# Altium project Triumvi_v11_sensing.PrjPcb
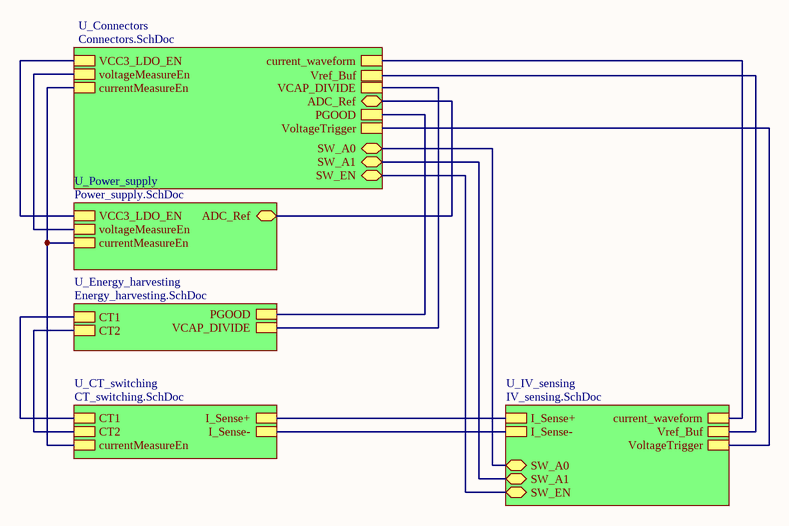
[diagram p0: top.SchDoc]
6 sheets, 69 parts. Net scope: hierarchical (ports join the sheet entries above them; power ports are global).
Board files: triumvi_v11_sensing.PcbDoc, triumvi_v11_sensing_panel.PcbDoc, triumvi_v11_sensing_panel_stencil.PcbDoc
Sheets:
  top.SchDoc
    U_Connectors = Connectors.SchDoc
    U_CT_switching = CT_switching.SchDoc
    U_Energy_harvesting = Energy_harvesting.SchDoc
    U_IV_sensing = IV_sensing.SchDoc
    U_Power_supply = Power_supply.SchDoc

## Sheet top.SchDoc: Triumvi - Sensing - Top
size Letter; Author: Ye-Sheng Kuo; Revision: 10; SheetNumber: 1; SheetTotal: 6

### Sub-sheets
U_Connectors = Connectors.SchDoc: current_waveform, Vref_Buf, VoltageTrigger, PGOOD, VCAP_DIVIDE, VCC3_LDO_EN, voltageMeasureEn, currentMeasureEn, ADC_Ref, SW_A0, SW_A1, SW_EN
U_CT_switching = CT_switching.SchDoc: CT1, CT2, currentMeasureEn, I_Sense+, I_Sense-
U_Energy_harvesting = Energy_harvesting.SchDoc: CT1, CT2, PGOOD, VCAP_DIVIDE
U_IV_sensing = IV_sensing.SchDoc: current_waveform, Vref_Buf, VoltageTrigger, I_Sense+, I_Sense-, SW_A1, SW_EN, SW_A0
U_Power_supply = Power_supply.SchDoc: VCC3_LDO_EN, voltageMeasureEn, currentMeasureEn, ADC_Ref

### Nets
VCC3: sheet U_Connectors/ADC_Ref, sheet U_Power_supply/ADC_Ref
CT1: sheet U_CT_switching/CT1, sheet U_Energy_harvesting/CT1
CT2: sheet U_CT_switching/CT2, sheet U_Energy_harvesting/CT2
current_waveform: sheet U_Connectors/current_waveform, sheet U_IV_sensing/current_waveform
currentMeasureEn: sheet U_Connectors/currentMeasureEn, sheet U_CT_switching/currentMeasureEn, sheet U_Power_supply/currentMeasureEn
in+: sheet U_CT_switching/I_Sense+, sheet U_IV_sensing/I_Sense+
in-: sheet U_CT_switching/I_Sense-, sheet U_IV_sensing/I_Sense-
PGOOD: sheet U_Connectors/PGOOD, sheet U_Energy_harvesting/PGOOD
SW_A0: sheet U_Connectors/SW_A0, sheet U_IV_sensing/SW_A0
SW_A1: sheet U_Connectors/SW_A1, sheet U_IV_sensing/SW_A1
SW_EN: sheet U_Connectors/SW_EN, sheet U_IV_sensing/SW_EN
VCAP: sheet U_Connectors/VCAP_DIVIDE, sheet U_Energy_harvesting/VCAP_DIVIDE
voltageMeasureEn: sheet U_Connectors/voltageMeasureEn, sheet U_Power_supply/voltageMeasureEn
VoltageTrigger: sheet U_Connectors/VoltageTrigger, sheet U_IV_sensing/VoltageTrigger
Vref_Buf: sheet U_Connectors/Vref_Buf, sheet U_IV_sensing/Vref_Buf
NetJ1_9: sheet U_Connectors/VCC3_LDO_EN, sheet U_Power_supply/VCC3_LDO_EN

### Notes on the sheet
- Title
- Date:
- Author:
- Revision:
- Sheet
- of
- University of Michigan
- File:

## Sheet Connectors.SchDoc: Triumvi - Sensing - Connectors
size Letter; Author: Ye-Sheng Kuo; Revision: 10; SheetNumber: 6; SheetTotal: 6
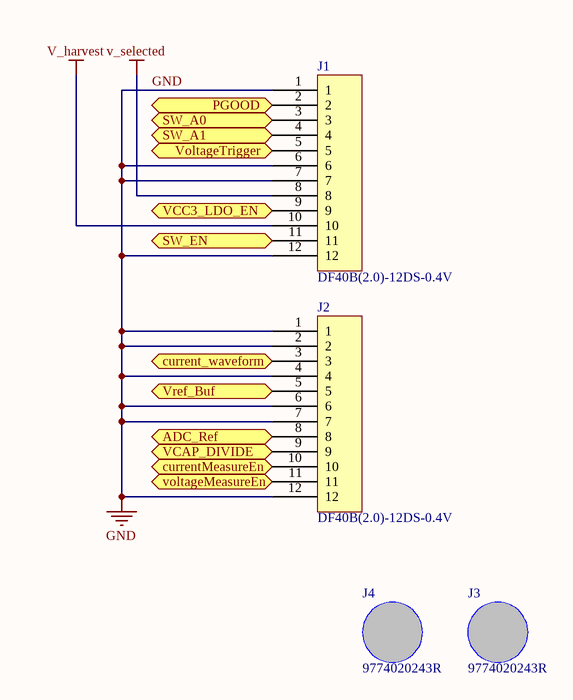
[diagram p1: Connectors.SchDoc]

### Parts
J1  DF40B(2.0)-12DS-0.4V  [DF40B(2.0)-12DS-0.4V]
J2  DF40B(2.0)-12DS-0.4V  [DF40B(2.0)-12DS-0.4V]
J3  9774020243R  [9774020243R]
J4  9774020243R  [9774020243R]

### Ports
ADC_Ref, current_waveform, currentMeasureEn, PGOOD, SW_A0, SW_A1, SW_EN, VCAP_DIVIDE, VCC3_LDO_EN, voltageMeasureEn, VoltageTrigger, Vref_Buf

### Nets
GND: J1.1 J1.6 J1.7 J1.12 J2.1 J2.2 J2.4 J2.6 J2.7 J2.12
V_harvest: J1.10
v_selected: J1.8
VCC3: J2.8 ; port ADC_Ref
current_waveform: J2.3 ; port current_waveform
currentMeasureEn: J2.10 ; port currentMeasureEn
PGOOD: J1.2 ; port PGOOD
SW_A0: J1.3 ; port SW_A0
SW_A1: J1.4 ; port SW_A1
SW_EN: J1.11 ; port SW_EN
VCAP: J2.9 ; port VCAP_DIVIDE
voltageMeasureEn: J2.11 ; port voltageMeasureEn
VoltageTrigger: J1.5 ; port VoltageTrigger
Vref_Buf: J2.5 ; port Vref_Buf
NetJ1_9: J1.9 ; port VCC3_LDO_EN

### Notes on the sheet
- Title
- Date:
- Author:
- Revision:
- Sheet
- of
- University of Michigan
- File:

### Library data of the parts
J1 J2 = DF40B(2.0)-12DS-0.4V: Hirose BM20 Series, 0.4mm pitch, 2mm stack height, 12 pos, header; Supplier 1: Digi-Key; Supplier Part Number 1: H124594CT-ND
J3 J4 = 9774020243R: 2 mm stack height, m2 standoff; Supplier 1: Digi-Key; Supplier Part Number 1: 732-7073-1-ND

## Sheet CT_switching.SchDoc: Triumvi - Sensing - CT Switching
size Letter; Author: Ye-Sheng Kuo; Revision: 10; SheetNumber: 5; SheetTotal: 6
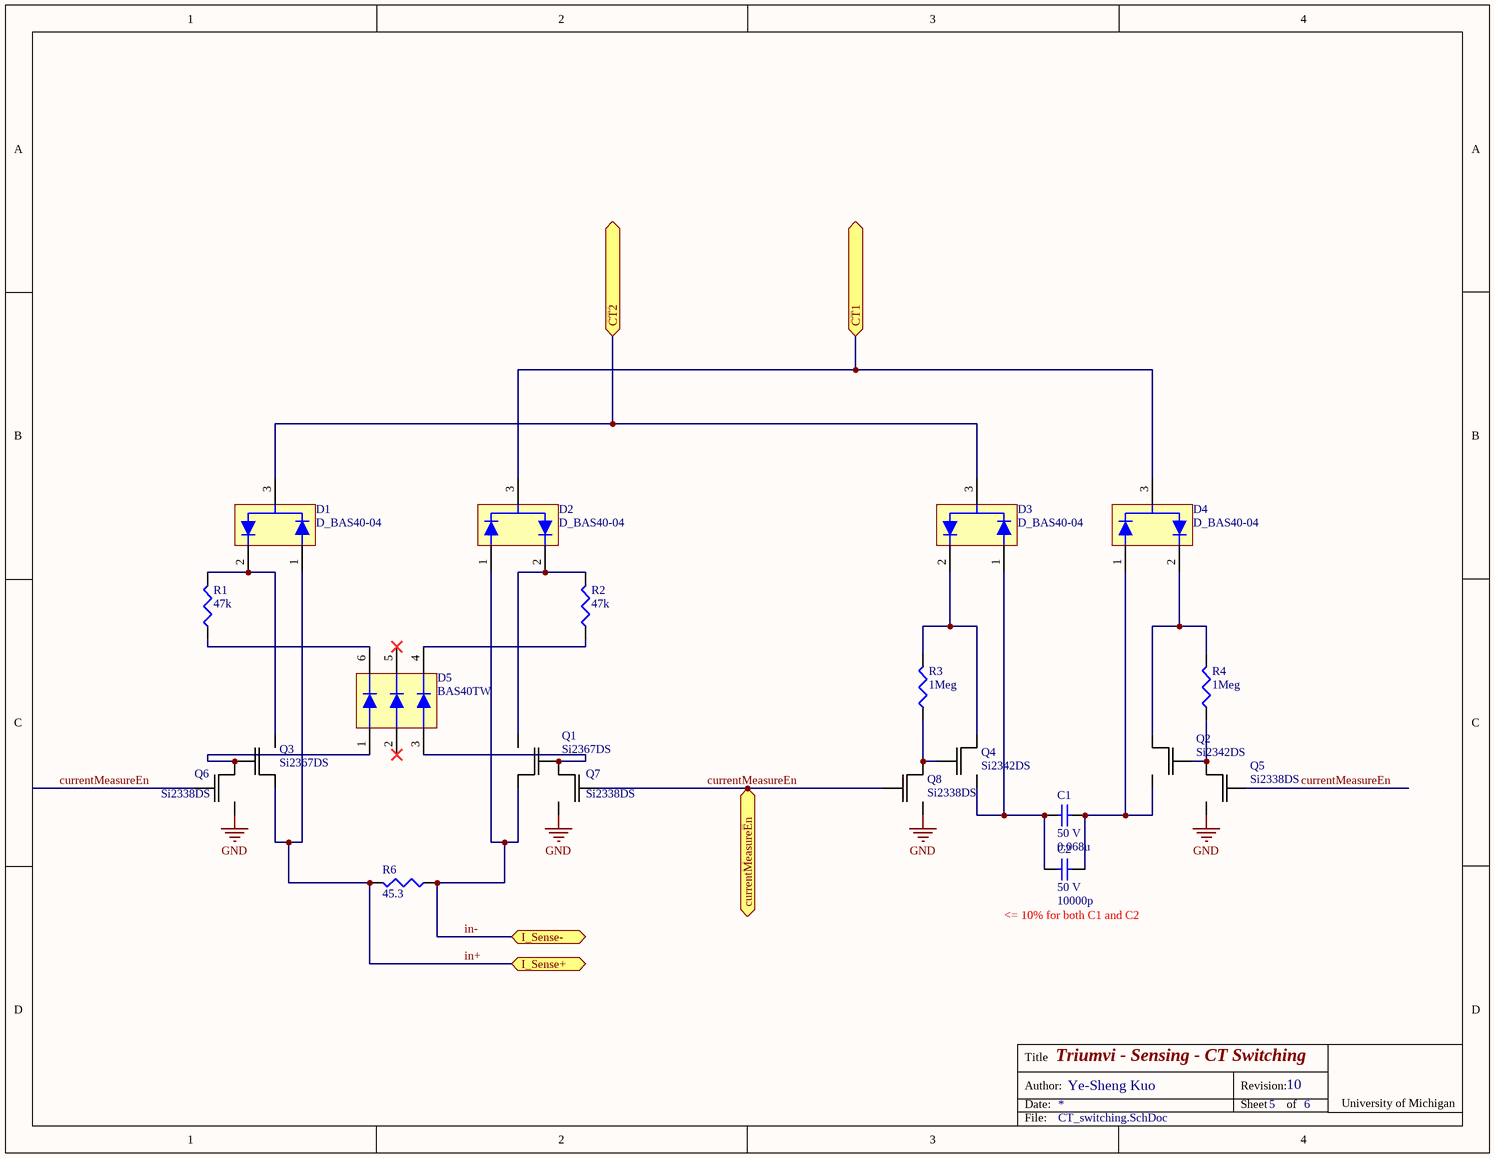
[diagram p2: CT_switching.SchDoc]

### Parts
C1  voltage rated: 50 V  [0603]  (hidden comment: 0.068u)
C2  voltage rated: 50 V  [0603]  (hidden comment: 10000p)
D1  D_BAS40-04  [SOT23-3]
D2  D_BAS40-04  [SOT23-3]
D3  D_BAS40-04  [SOT23-3]
D4  D_BAS40-04  [SOT23-3]
D5  BAS40TW  [SOT-363]
Q1  Si2367DS  [SOT23-3]
Q2  Si2342DS  [SOT23-3]
Q3  Si2367DS  [SOT23-3]
Q4  Si2342DS  [SOT23-3]
Q5  Si2338DS  [SOT23-3]
Q6  Si2338DS  [SOT23-3]
Q7  Si2338DS  [SOT23-3]
Q8  Si2338DS  [SOT23-3]
R1  47k  [0402]
R2  47k  [0402]
R3  1Meg  [0402]
R4  1Meg  [0402]
R6  45.3  [0603]

### Ports
CT1, CT2, currentMeasureEn, I_Sense+, I_Sense-

### Nets
GND: Q5.2(S) Q6.2(S) Q7.2(S) Q8.2(S)
CT1: D2.3 D4.3 ; port CT1
CT2: D1.3 D3.3 ; port CT2
currentMeasureEn: Q5.1(G) Q6.1(G) Q7.1(G) Q8.1(G) ; port currentMeasureEn
in+: D1.1 Q3.3(D) R6.1 ; port I_Sense+
in-: D2.1 Q1.3(D) R6.2 ; port I_Sense-
NetC1_1: C1.1 C2.1 D3.1 Q4.2(S)
NetC1_2: C1.2 C2.2 D4.1 Q2.2(S)
NetD1_2: D1.2 Q3.2(S) R1.1
NetD2_2: D2.2 Q1.2(S) R2.1
NetD3_2: D3.2 Q4.3(D) R3.1
NetD4_2: D4.2 Q2.3(D) R4.1
NetD5_1: D5.1 Q3.1(G) Q6.3(D)
NetD5_3: D5.3 Q1.1(G) Q7.3(D)
NetD5_4: D5.4 R2.2
NetD5_6: D5.6 R1.2
NetQ2_1: Q2.1(G) Q5.3(D) R4.2
NetQ4_1: Q4.1(G) Q8.3(D) R3.2

Not connected (* = marked no-connect by the designer): D5 2* 5*

### Notes on the sheet
- (near C2) <= 10% for both C1 and C2
- Title
- Date:
- Author:
- Revision:
- Sheet
- of
- University of Michigan
- File:

### Library data of the parts
C1 = C0603C683K5RACTU: 0.068µF ±10% 50V Ceramic Capacitor X7R 0603; Manufacture: Kemet; tolerance: 10%; package: 0603; Supplier 1: Digi-Key; Supplier Part Number 1: 399-7955-1-ND; Value: 0.068u; Temperature Coefficient: X7R; Manufacturer Part Number: C0603C683K5RACTU
C2 = C0603C103J5RACTU: 10000pF ±5% 50V Ceramic Capacitor X7R 0603; Manufacture: Kemet; tolerance: 5%; package: 0603; Supplier 1: Digi-Key; Supplier Part Number 1: 399-1092-6-ND; Value: 10000p; Temperature Coefficient: X7R; Manufacturer Part Number: C0603C103J5RACTU
D1-D4 = D_BAS40-04: SURFACE MOUNT SCHOTTKY BARRIER DIODE; Supplier 1: Digi-Key; Supplier Part Number 1: BAS40-04FDICT-ND
D5 = D_BAS40TW: SURFACE MOUNT SCHOTTKY BARRIER DIODE ARRAYS; Supplier 1: Digi-Key; Supplier Part Number 1: BAS40TW-FDICT-ND
Q1 Q3 = Si2367DS: P-Channel 20 V (D-S) MOSFET; Supplier 1: Digi-Key; Supplier Part Number 1: SI2367DS-T1-GE3CT-ND
Q2 Q4 = Si2342DS: N-Channel 8 V (D-S) MOSFET; Supplier 1: Digi-Key; Supplier Part Number 1: SI2342DS-T1-GE3CT-ND
Q5-Q8 = Si2338DS: N-Channel 30 V (D-S) MOSFET; Supplier 1: Digi-Key; Supplier Part Number 1: SI2338DS-T1-GE3CT-ND
R1 R2 = CRCW040247K0FKED: RES SMD 47K OHM 1% 1/16W 0402; Manufacturer: Vishay Dale; Temperature Coefficient: 100 ppm/C; Tolerance: 1%; Power: 1/16 W; package: 0402; Supplier 1: Digi-Key; Supplier Part Number 1: 541-47.0KLCT-ND; value: 47k; Manufacturer Part Number: CRCW040247K0FKED
R3 R4 = CRCW04021M00FKED: RES SMD 1M OHM 1% 1/16W 0402; Manufacturer: Vishay Dale; Temperature Coefficient: 100 ppm/C; Tolerance: 1%; Power: 1/16 W; Supplier 1: Digi-Key; Supplier Part Number 1: 541-1.00MLCT-ND; package: 0402; value: 1Meg; Manufacturer Part Number: CRCW04021M00FKED
R6 = RP73PF1J45R3BTDF: RES SMD 45.3 OHM 0.1% 1/6W 0603; Manufacturer: TE Connectivity; Temperature Coefficient: 25 ppm/C; Power: 1/6 W; package: 0603; Supplier 1: Digi-Key; Supplier Part Number 1: A109979CT-ND; Tolerance: 0.1%; value: 45.3; Manufacturer Part Number: RP73PF1J45R3BTDF

## Sheet Energy_harvesting.SchDoc: Triumvi - Sensing - Energy Harvesting
size Letter; Author: Ye-Sheng Kuo; Revision: 10; SheetNumber: 2; SheetTotal: 6
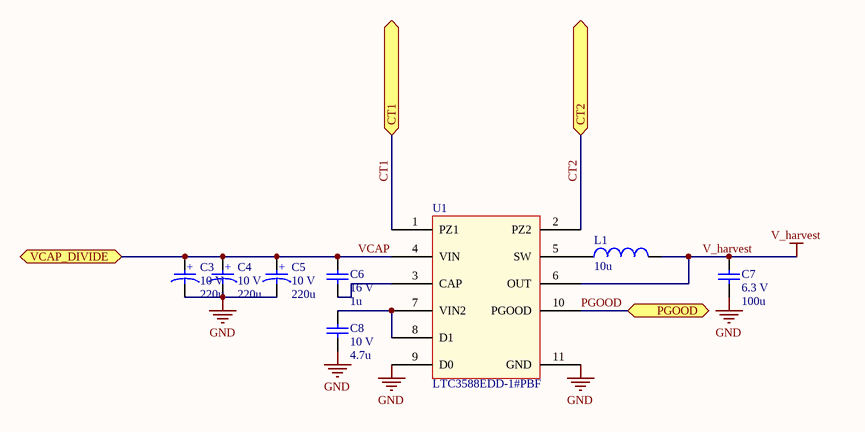
[diagram p3: Energy_harvesting.SchDoc]

### Parts
C3  voltage rated: 10 V  [2312]  (hidden comment: 220u)
C4  voltage rated: 10 V  [2312]  (hidden comment: 220u)
C5  voltage rated: 10 V  [2312]  (hidden comment: 220u)
C6  voltage rated: 16 V  [0402]  (hidden comment: 1u)
C7  voltage rated: 6.3 V  [1206]  (hidden comment: 100u)
C8  voltage rated: 10 V  [0603]  (hidden comment: 4.7u)
L1  10u  [CDRH2D18]
U1  LTC3588EDD-1#PBF  [QFN-10]

### Ports
CT1, CT2, PGOOD, VCAP_DIVIDE

### Nets
GND: C3.2 C4.2 C5.2 C7.2 C8.2 U1.9(D0) U1.11(GND)
V_harvest: C7.1 L1.1 U1.6(OUT)
CT1: U1.1(PZ1) ; port CT1
CT2: U1.2(PZ2) ; port CT2
PGOOD: U1.10(PGOOD) ; port PGOOD
VCAP: C3.1 C4.1 C5.1 C6.1 U1.4(VIN) ; port VCAP_DIVIDE
NetC6_2: C6.2 U1.3(CAP)
NetC8_1: C8.1 U1.7(VIN2) U1.8(D1)
NetL1_2: L1.2 U1.5(SW)

### Notes on the sheet
- Title
- Date:
- Author:
- Revision:
- Sheet
- of
- University of Michigan
- File:
- (in symbol TAJC227K010RNJ) +

### Library data of the parts
C3-C5 = TAJC227K010RNJ: 220µF ±10% Molded Tantalum Capacitors 10V 2312; Manufacture: AVX; ESR: 500m Ohm; tolerance: 10%; package: 2312; Supplier 1: Digi-Key; Supplier Part Number 1: 478-4774-1-ND; Value: 220u; Manufacturer Part Number: TAJC227K010RNJ
C6 = C1005X6S1C105K050BC: 1µF ±10% 16V Ceramic Capacitor X6S 0402; Manufacture: TDK; tolerance: 10%; package: 0402; Supplier 1: Digi-Key; Supplier Part Number 1: 445-9086-1-ND; Value: 1u; Temperature Coefficient: X6S; Manufacturer Part Number: C1005X6S1C105K050BC
C7 = GRM31CR60J107ME39K: 100µF ±20% 6.3V Ceramic Capacitor X5R 1206; Manufacture: Kemet; tolerance: 20%; package: 1206; Supplier 1: Digi-Key; Supplier Part Number 1: 490-7217-1-ND; Value: 100u; Temperature Coefficient: X5R; Manufacturer Part Number: GRM31CR60J107ME39K
C8 = CGB3B1X5R1A475K055AC: 4.7µF ±10% 10V Ceramic Capacitor X5R 0603; Manufacture: TDK; tolerance: 10%; package: 0603; Supplier 1: Digi-Key; Supplier Part Number 1: 445-7482-1-ND; Value: 4.7u; Temperature Coefficient: X5R; Manufacturer Part Number: CGB3B1X5R1A475K055AC
L1 = CDRH2D18/LDNP-100NC: 10µH Shielded Inductor 1A 180 mOhm Max Nonstandard; Manufacturer: Sumida; tolerance: 30%; DCR (Max): 180m; Supplier 1: Digi-Key; Supplier Part Number 1: 308-1959-1-ND; Value: 10u; Current Rating: 1 A; Manufacturer Part Number: CDRH2D18/LDNP-100NC
U1 = LTC3588EDD-1#PBF: Piezoelectric Energy Harvesting Power Supply; Supplier 1: Digi-Key; Supplier Part Number 1: LTC3588EDD-1#PBF-ND

## Sheet IV_sensing.SchDoc: Triumvi - Sensing - IV Sensing
size Letter; Author: Ye-Sheng Kuo; Revision: 10; SheetNumber: 3; SheetTotal: 6
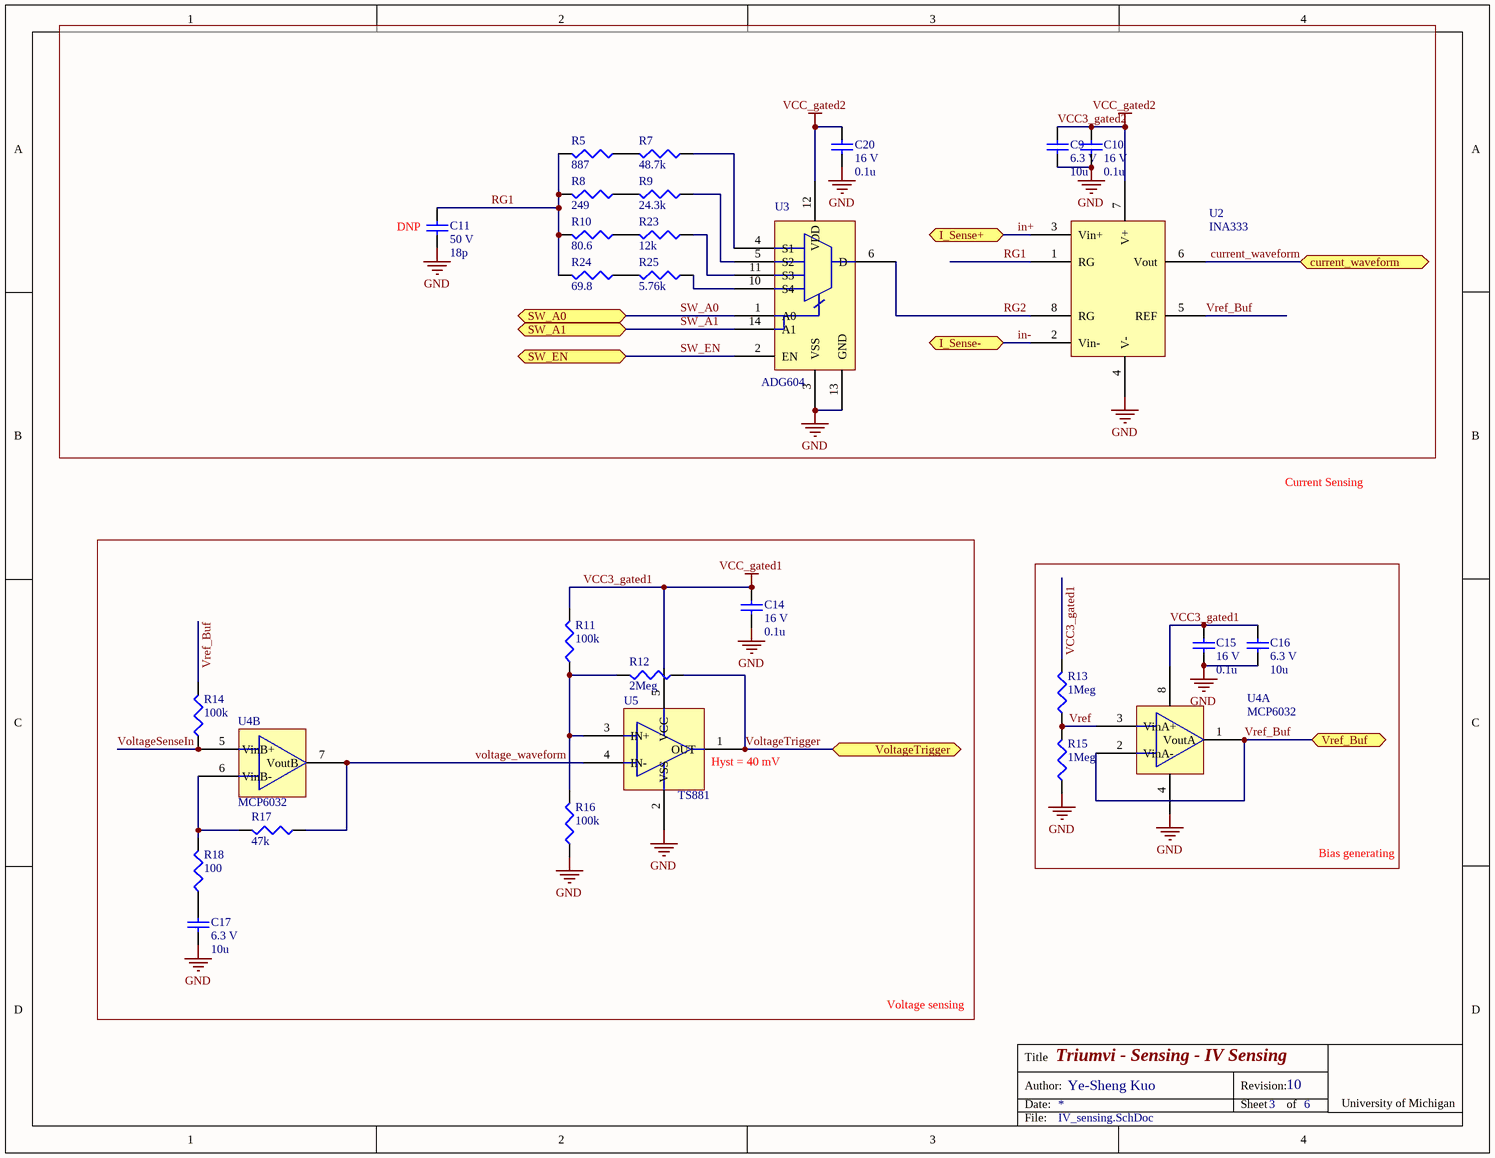
[diagram p4: IV_sensing.SchDoc]

### Parts
C9  voltage rated: 6.3 V  [0603]  (hidden comment: 10u)
C10  voltage rated: 16 V  [0402]  (hidden comment: 0.1u)
C11  voltage rated: 50 V  [0402]  (hidden comment: 18p)
C14  voltage rated: 16 V  [0402]  (hidden comment: 0.1u)
C15  voltage rated: 16 V  [0402]  (hidden comment: 0.1u)
C16  voltage rated: 6.3 V  [0603]  (hidden comment: 10u)
C17  voltage rated: 6.3 V  [0603]  (hidden comment: 10u)
C20  voltage rated: 16 V  [0402]  (hidden comment: 0.1u)
R5  887  [0402]
R7  48.7k  [0402]
R8  249  [0402]
R9  24.3k  [0402]
R10  80.6  [0402]
R11  100k  [0402]
R12  2Meg  [0402]
R13  1Meg  [0402]
R14  100k  [0402]
R15  1Meg  [0402]
R16  100k  [0402]
R17  47k  [0402]
R18  100  [0402]
R23  12k  [0402]
R24  69.8  [0402]
R25  5.76k  [0402]
U2  INA333  [MSOP-8]
U3  ADG604  [TSSOP-14]
U4  MCP6032  [MSOP-8]  (parts A,B of 2)
U5  TS881  [SC70-5]

### Blocks framed on the sheet
DNP: C9-C11 C20 R5 R7-R10 R23-R25 U2 U3
Bias generating: C15 C16 R13 R15 U4

### Ports
current_waveform, I_Sense+, I_Sense-, SW_A0, SW_A1, SW_EN, VoltageTrigger, Vref_Buf

### Nets
GND: C9.2 C10.2 C11.2 C14.2 C15.2 C16.2 C17.2 C20.2 R15.2 R16.2 U2.4(V-) U3.3(VSS) U3.13(GND) U4.4(VSS) U5.2(VSS)
VCC3_gated1: C14.1 C15.1 C16.1 R11.1 R13.1 U4.8(VDD) U5.5(VCC)  [also labelled VCC_gated1]
VCC3_gated2: C9.1 C10.1 C20.1 U2.7(V+) U3.12(VDD)  [also labelled VCC_gated2]
current_waveform: U2.6(Vout) ; port current_waveform
in+: U2.3(Vin+) ; port I_Sense+
in-: U2.2(Vin-) ; port I_Sense-
RG1: C11.1 R5.1 R8.1 R10.1 R24.1 U2.1(RG)
RG2: U2.8(RG) U3.6(D)
SW_A0: U3.1(A0) ; port SW_A0
SW_A1: U3.14(A1) ; port SW_A1
SW_EN: U3.2(EN) ; port SW_EN
voltage_waveform: R17.2 U4.7(VoutB) U5.4(IN-)
VoltageSenseIn: R14.2 U4.5(VinB+)
VoltageTrigger: R12.2 U5.1(OUT) ; port VoltageTrigger
Vref: R13.2 R15.1 U4.3(VinA+)
Vref_Buf: R14.1 U2.5(REF) U4.1(VoutA) U4.2(VinA-) ; port Vref_Buf
NetC17_1: C17.1 R18.2
NetR5_2: R5.2 R7.1
NetR7_2: R7.2 U3.4(S1)
NetR8_2: R8.2 R9.1
NetR9_2: R9.2 U3.5(S2)
NetR10_2: R10.2 R23.1
NetR11_2: R11.2 R12.1 R16.1 U5.3(IN+)
NetR17_1: R17.1 R18.1 U4.6(VinB-)
NetR23_2: R23.2 U3.11(S3)
NetR24_2: R24.2 R25.1
NetR25_2: R25.2 U3.10(S4)

### Notes on the sheet
- Current Sensing
- (near U5) Hyst = 40 mV
- Voltage sensing
- Title
- Date:
- Author:
- Revision:
- Sheet
- of
- University of Michigan
- File:

### Library data of the parts
C9 C16 C17 = C1608X5R0J106M080AB: 10µF ±20% 6.3V Ceramic Capacitor X5R 0603; Manufacture: TDK; tolerance: 20%; package: 0603; Supplier 1: Digi-Key; Supplier Part Number 1: 445-4112-1-ND; Value: 10u; Temperature Coefficient: X5R; Manufacturer Part Number: C1608X5R0J106M080AB
C10 C14 C15 C20 = GRM155R71C104KA88D: 0.10µF ±10% 16V Ceramic Capacitor X7R 0402; Manufacture: Murata; tolerance: 10%; package: 0402; Supplier 1: Digi-Key; Supplier Part Number 1: 490-3261-1-ND; Value: 0.1u; Temperature Coefficient: X7R; Manufacturer Part Number: GRM155R71C104KA88D
C11 = 500R07S180GV4T: 18pF ±2% 50V Ceramic Capacitor C0G, NP0 0402; Manufacture: Johanson Technology Inc.; Note: RF application; tolerance: 2%; package: 0402; Temperature Coefficient: C0G, NP0; Manufacturer Part Number: 500R07S180GV4T; Supplier 1: Digi-Key; Supplier Part Number 1: 712-1264-1-ND; Value: 18p
R5 = CRCW0402887RFKED: RES SMD 887 OHM 1% 1/16W 0402; Manufacturer: Vishay Dale; Temperature Coefficient: 100 ppm/C; package: 0402; Manufacturer Part Number: CRCW0402887RFKED; Power: 1/16 W; Tolerance: 1%; Supplier 1: Digi-Key; Supplier Part Number 1: 541-887LCT-ND; value: 887
R7 = RT0402DRD0748K7L: RES SMD 48.7K OHM 0.5% 1/16W 0402; Manufacturer: Yageo; Temperature Coefficient: 25 ppm/C; package: 0402; Manufacturer Part Number: RT0402DRD0748K7L; Power: 1/16 W; Tolerance: 0.5%; Supplier 1: Digi-Key; Supplier Part Number 1: 311-2188-1-ND; value: 48.7k
R8 = CRCW0402249RFKED: RES SMD 249 OHM 1% 1/16W 0402; Manufacturer: Vishay Dale; Temperature Coefficient: 100 ppm/C; package: 0402; Manufacturer Part Number: CRCW0402249RFKED; Power: 1/16 W; Tolerance: 1%; Supplier 1: Digi-Key; Supplier Part Number 1: 541-249LCT-ND; value: 249
R9 = RC0402FR-0724K3L: RES SMD 24.3K OHM 0.5% 1/16W 0402; Manufacturer: Yageo; Temperature Coefficient: 100 ppm/C; Tolerance: 1%; package: 0402; Manufacturer Part Number: RC0402FR-0724K3L; Power: 1/16 W; Supplier 1: Digi-Key; Supplier Part Number 1: YAG3071CT-ND; value: 24.3k
R10 = CRCW040280R6FKED: RES SMD 80.6 OHM 1% 1/16W 0402; Manufacturer: Vishay Dale; Temperature Coefficient: 100 ppm/C; package: 0402; Manufacturer Part Number: CRCW040280R6FKED; Power: 1/16 W; Tolerance: 1%; Supplier 1: Digi-Key; Supplier Part Number 1: 541-80.6LCT-ND; value: 80.6
R11 R14 R16 = CRCW0402100KFKED: RES SMD 100K OHM 1% 1/16W 0402; Manufacturer: Vishay Dale; Temperature Coefficient: 100 ppm/C; Tolerance: 1%; Power: 1/16 W; Supplier 1: Digi-Key; Supplier Part Number 1: 541-100KLCT-ND; package: 0402; value: 100k; Manufacturer Part Number: CRCW0402100KFKED
R12 = CRCW04022M00FKED: RES SMD 2M OHM 1% 1/16W 0402; Manufacturer: Vishay Dale; Temperature Coefficient: 100 ppm/C; Tolerance: 1%; Power: 1/16 W; package: 0402; Supplier 1: Digi-Key; Supplier Part Number 1: 541-2.00MLCT-ND; value: 2Meg; Manufacturer Part Number: CRCW04022M00FKED
R13 R15 = CRCW04021M00FKED: as R3 on sheet CT_switching; Tolerance: 1%; Power: 1/16 W; Supplier 1: Digi-Key; Supplier Part Number 1: 541-1.00MLCT-ND; package: 0402; value: 1Meg; Manufacturer Part Number: CRCW04021M00FKED
R17 = CRCW040247K0FKED: as R1 on sheet CT_switching; Tolerance: 1%; Power: 1/16 W; package: 0402; Supplier 1: Digi-Key; Supplier Part Number 1: 541-47.0KLCT-ND; value: 47k; Manufacturer Part Number: CRCW040247K0FKED
R18 = CRCW0402100RFKED: RES SMD 100 OHM 1% 1/16W 0402; Manufacturer: Vishay Dale; Temperature Coefficient: 100 ppm/C; Tolerance: 1%; Power: 1/16 W; package: 0402; Supplier 1: Digi-Key; Supplier Part Number 1: 541-100LCT-ND; value: 100; Manufacturer Part Number: CRCW0402100RFKED
R23 = RT0402DRD0712KL: RES SMD 12K OHM 0.5% 1/16W 0402; Manufacturer: Yageo; Temperature Coefficient: 25 ppm/C; package: 0402; Manufacturer Part Number: RT0402DRD0712KL; Power: 1/16 W; Tolerance: 0.5%; Supplier 1: Digi-Key; Supplier Part Number 1: 311-2140-1-ND; value: 12k
R24 = CRCW040269R8FKED: RES SMD 69.8 OHM 1% 1/16W 0402; Manufacturer: Vishay Dale; Temperature Coefficient: 100 ppm/C; package: 0402; Manufacturer Part Number: CRCW040269R8FKED; Power: 1/16 W; Tolerance: 1%; Supplier 1: Digi-Key; Supplier Part Number 1: 541-69.8LCT-ND; value: 69.8
R25 = RC0402FR-075K76L: RES SMD 5.76K OHM 0.5% 1/16W 0402; Manufacturer: Yageo; Temperature Coefficient: 100 ppm/C; Tolerance: 1%; package: 0402; Manufacturer Part Number: RC0402FR-075K76L; Power: 1/16 W; Supplier 1: Digi-Key; Supplier Part Number 1: YAG3196CT-ND; value: 5.76k
U2 = INA333: Micro-Power (50uA), Zero-Drift, Rail-to-Rail Out  Instrumentation Amplifier; Supplier 1: Digi-Key; Supplier Part Number 1: 296-23564-1-ND
U3 = ADG604: 1 pC Charge Injection, 100 pA Leakage  CMOS  5 V/5 V/3 V 4-Channel Multiplexer; Supplier 1: Digi-Key; Supplier Part Number 1: ADG604YRUZ-ND
U4 = MCP6032: 0.9 µA, High Precision Op Amps; Supplier 1: Digi-Key; Supplier Part Number 1: MCP6032-E/MS-ND
U5 = TS881: Rail-to-rail 0.9 V nanopower comparator; Supplier 1: Digi-Key; Supplier Part Number 1: 497-13217-1-ND

## Sheet Power_supply.SchDoc: Triumvi - Sensing - Power Supply
size Letter; Author: Ye-Sheng Kuo; Revision: 10; SheetNumber: 4; SheetTotal: 6
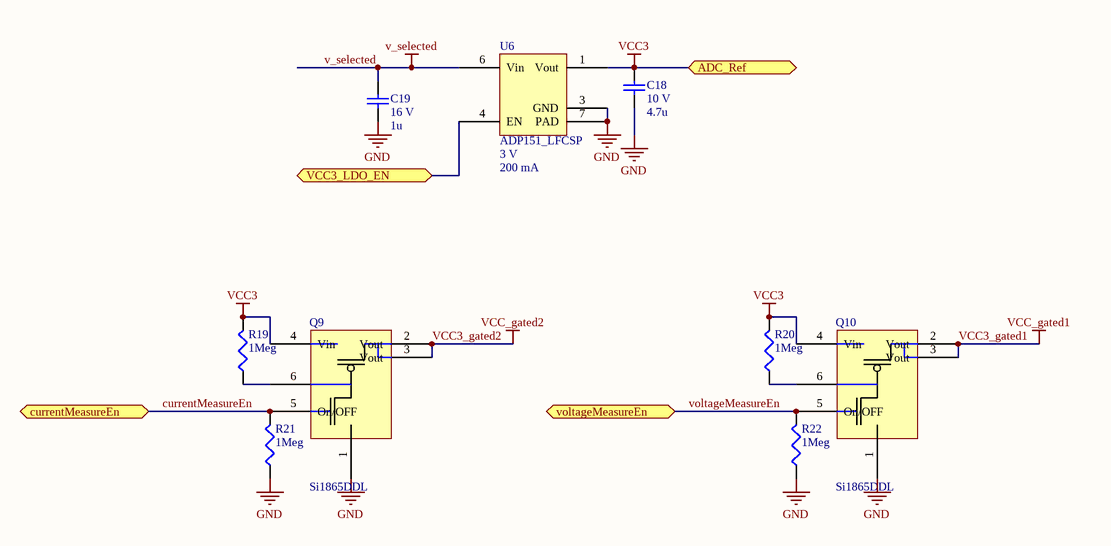
[diagram p5: Power_supply.SchDoc]

### Parts
C18  voltage rated: 10 V  [0603]  (hidden comment: 4.7u)
C19  voltage rated: 16 V  [0402]  (hidden comment: 1u)
Q9  Si1865DDL  [SC70-6]
Q10  Si1865DDL  [SC70-6]
R19  1Meg  [0402]
R20  1Meg  [0402]
R21  1Meg  [0402]
R22  1Meg  [0402]
U6  ADP151_LFCSP  Voltage: 3 V  Current: 200 mA  [CP-6-3]

### Ports
ADC_Ref, currentMeasureEn, VCC3_LDO_EN, voltageMeasureEn

### Nets
GND: C18.2 C19.2 Q9.1(S1) Q10.1(S1) R21.2 R22.2 U6.3(GND) U6.7(PAD)
v_selected: C19.1 U6.6(Vin)
VCC3: C18.1 Q9.4(Vin) Q10.4(Vin) R19.1 R20.1 U6.1(Vout) ; port ADC_Ref
VCC3_gated1: Q10.2(Vout) Q10.3(Vout)  [also labelled VCC_gated1]
VCC3_gated2: Q9.2(Vout) Q9.3(Vout)  [also labelled VCC_gated2]
currentMeasureEn: Q9.5(On/OFF) R21.1 ; port currentMeasureEn
voltageMeasureEn: Q10.5(On/OFF) R22.1 ; port voltageMeasureEn
NetJ1_9: U6.4(EN) ; port VCC3_LDO_EN
NetQ9_6: Q9.6(D1) R19.2
NetQ10_6: Q10.6(D1) R20.2

### Notes on the sheet
- Title
- Date:
- Author:
- Revision:
- Sheet
- of
- University of Michigan
- File:

### Library data of the parts
C18 = CGB3B1X5R1A475K055AC: as C8 on sheet Energy_harvesting; tolerance: 10%; package: 0603; Supplier 1: Digi-Key; Supplier Part Number 1: 445-7482-1-ND; Value: 4.7u; Temperature Coefficient: X5R; Manufacturer Part Number: CGB3B1X5R1A475K055AC
C19 = C1005X6S1C105K050BC: as C6 on sheet Energy_harvesting; tolerance: 10%; package: 0402; Supplier 1: Digi-Key; Supplier Part Number 1: 445-9086-1-ND; Value: 1u; Temperature Coefficient: X6S; Manufacturer Part Number: C1005X6S1C105K050BC
Q9 Q10 = Si1865DDL: Load Switch with Level-Shift; Supplier 1: Digi-Key; Supplier Part Number 1: SI1865DDL-T1-GE3CT-ND
R19-R22 = CRCW04021M00FKED: as R3 on sheet CT_switching; Tolerance: 1%; Power: 1/16 W; Supplier 1: Digi-Key; Supplier Part Number 1: 541-1.00MLCT-ND; package: 0402; value: 1Meg; Manufacturer Part Number: CRCW04021M00FKED
U6 = ADP151_LFCSP: Ultralow Noise, 200 mA,  CMOS Linear Regulator; Supplier 1: Digi-Key; Supplier Part Number 1: ADP151ACPZ-3.0-R7CT-ND

## Nets that join several sheets
GND: Connectors (10 pins), CT_switching (Q5.2 Q6.2 Q7.2 Q8.2), Energy_harvesting (7 pins), IV_sensing (15 pins), Power_supply (8 pins)
V_harvest: Connectors (J1.10), Energy_harvesting (C7.1 L1.1 U1.6)
v_selected: Connectors (J1.8), Power_supply (C19.1 U6.6)
VCC3: Connectors (J2.8), Power_supply (6 pins)
VCC3_gated1: IV_sensing (7 pins), Power_supply (Q10.2 Q10.3)
VCC3_gated2: IV_sensing (5 pins), Power_supply (Q9.2 Q9.3)
CT1: CT_switching (D2.3 D4.3), Energy_harvesting (U1.1)
CT2: CT_switching (D1.3 D3.3), Energy_harvesting (U1.2)
current_waveform: Connectors (J2.3), IV_sensing (U2.6)
currentMeasureEn: Connectors (J2.10), CT_switching (Q5.1 Q6.1 Q7.1 Q8.1), Power_supply (Q9.5 R21.1)
in+: CT_switching (D1.1 Q3.3 R6.1), IV_sensing (U2.3)
in-: CT_switching (D2.1 Q1.3 R6.2), IV_sensing (U2.2)
NetJ1_9: Connectors (J1.9), Power_supply (U6.4)
PGOOD: Connectors (J1.2), Energy_harvesting (U1.10)
SW_A0: Connectors (J1.3), IV_sensing (U3.1)
SW_A1: Connectors (J1.4), IV_sensing (U3.14)
SW_EN: Connectors (J1.11), IV_sensing (U3.2)
VCAP: Connectors (J2.9), Energy_harvesting (5 pins)
voltageMeasureEn: Connectors (J2.11), Power_supply (Q10.5 R22.1)
VoltageTrigger: Connectors (J1.5), IV_sensing (R12.2 U5.1)
Vref_Buf: Connectors (J2.5), IV_sensing (R14.1 U2.5 U4.1 U4.2)